# Altium schematic sheet Regulator.SchDoc
size A; SheetNumber: 2; SheetTotal: 2
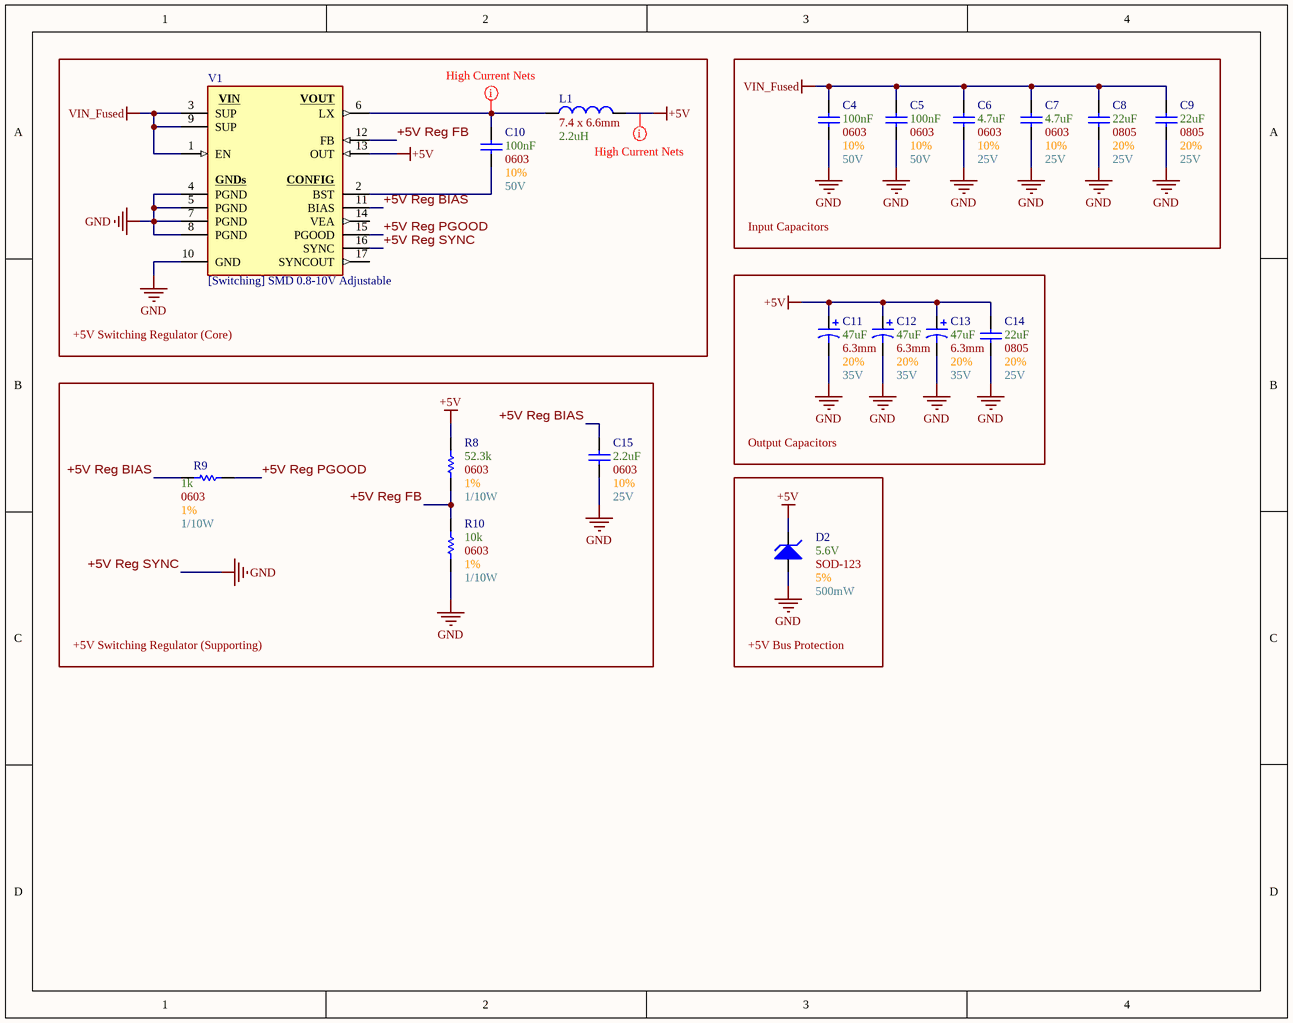
[diagram p0: Regulator.SchDoc]

## Parts
C4  Max Voltage: 50V  Size Package: 0603  Tolerance: 10%  Capacitance: 100nF  [[Cap] SMD 0603]  (hidden comment: [Cap] 0603 0.1uF 10% 50V)
C5  Max Voltage: 50V  Size Package: 0603  Tolerance: 10%  Capacitance: 100nF  [[Cap] SMD 0603]  (hidden comment: [Cap] 0603 0.1uF 10% 50V)
C6  Max Voltage: 25V  Size Package: 0603  Tolerance: 10%  Capacitance: 4.7uF  [[Cap] SMD 0603]  (hidden comment: [Cap] 0603 4.7uF 10% 25V)
C7  Max Voltage: 25V  Size Package: 0603  Tolerance: 10%  Capacitance: 4.7uF  [[Cap] SMD 0603]  (hidden comment: [Cap] 0603 4.7uF 10% 25V)
C8  Max Voltage: 25V  Size Package: 0805  Tolerance: 20%  Capacitance: 22uF  [[Cap] SMD 0805]  (hidden comment: [Cap] 0805 22uF 20% 25V)
C9  Max Voltage: 25V  Size Package: 0805  Tolerance: 20%  Capacitance: 22uF  [[Cap] SMD 0805]  (hidden comment: [Cap] 0805 22uF 20% 25V)
C10  Max Voltage: 50V  Size Package: 0603  Tolerance: 10%  Capacitance: 100nF  [[Cap] SMD 0603]  (hidden comment: [Cap] 0603 0.1uF 10% 50V)
C11  Max Voltage: 35V  Size Package: 6.3mm  Tolerance: 20%  Capacitance: 47uF  [[Cap] SMD Polarized, 6.3mm]  (hidden comment: [Cap] 6.3mm 47uF 20% 35V)
C12  Max Voltage: 35V  Size Package: 6.3mm  Tolerance: 20%  Capacitance: 47uF  [[Cap] SMD Polarized, 6.3mm]  (hidden comment: [Cap] 6.3mm 47uF 20% 35V)
C13  Max Voltage: 35V  Size Package: 6.3mm  Tolerance: 20%  Capacitance: 47uF  [[Cap] SMD Polarized, 6.3mm]  (hidden comment: [Cap] 6.3mm 47uF 20% 35V)
C14  Max Voltage: 25V  Size Package: 0805  Tolerance: 20%  Capacitance: 22uF  [[Cap] SMD 0805]  (hidden comment: [Cap] 0805 22uF 20% 25V)
C15  Max Voltage: 25V  Size Package: 0603  Tolerance: 10%  Capacitance: 2.2uF  [[Cap] SMD 0603]  (hidden comment: [Cap] 0603 2.2uF 10% 25V)
D2  Tolerance: 5%  Wattage: 500mW  Optimal Zener Voltage: 5.6V  [[Diode] SMD SOD-123]  (hidden comment: SOD-123)
L1  Package: 7.4 x 6.6mm  Inductance: 2.2uH  [[Inductor] SMD 7.4 X 6.6 X 3 MM]  (hidden comment: [2.2uH] SMD Nonstandard 10A)
R8  Wattage: 1/10W  Tolerance: 1%  Resistance: 52.3k  Size Package: 0603  [[Res] SMD 0603]  (hidden comment: [52.3k] SMD 0603 1% 1/10W)
R9  Wattage: 1/10W  Tolerance: 1%  Resistance: 1k  Size Package: 0603  [[Res] SMD 0603]  (hidden comment: [1k] SMD 0603 1% 1/10W)
R10  Wattage: 1/10W  Tolerance: 1%  Resistance: 10k  Size Package: 0603  [[Res] SMD 0603]  (hidden comment: [10k] SMD 0603 1% 1/8W)
V1  [Switching] SMD 0.8-10V Adjustable  [[Switching] 0.8-10V Adjustable Buck]

## Blocks framed on the sheet
+5V Switching Regulator (Core): C10 L1 V1
Input Capacitors: C4-C9
Output Capacitors: C11-C14
+5V Switching Regulator (Supporting): C15 R8-R10
+5V Bus Protection: D2

## Nets
+5V: C11.1 C12.1 C13.1 C14.2 D2.1(K) L1.2 R8.2 V1.13(OUT)
+5V Reg SYNC: C4.1 C5.1 C6.1 C7.1 C8.1 C9.1 C11.2 C12.2 C13.2 C14.1 C15.1 D2.2(A) R10.1 V1.4(PGND) V1.5(PGND) V1.7(PGND) V1.8(PGND) V1.10(GND) V1.16(SYNC)  [also labelled GND]
VIN_Fused: C4.2 C5.2 C6.2 C7.2 C8.2 C9.2 V1.1(EN) V1.3(SUP) V1.9(SUP)
+5V Reg BIAS: C15.2 R9.1 V1.11(BIAS)
+5V Reg FB: R8.1 R10.2 V1.12(FB)
+5V Reg PGOOD: R9.2 V1.15(PGOOD)
NetC10_1: C10.1 V1.2(BST)
NetC10_2: C10.2 L1.1 V1.6(LX)

Not connected (* = marked no-connect by the designer): V1 14(VEA) 17(SYNCOUT)

## Layout directives
net class High_Current_Nets: +5V, NetC10_2

## Notes on the sheet
- (in symbol [Switching] SMD 0.8-10V Adjustable) VIN; VOUT; GNDs; CONFIG

## Library data of the parts
C4 C5 C10 = [Cap] 0603 0.1uF 10% 50V: CL10B104KB8NNNC; Supplier 1: DigiKey; Supplier Part Number 1: 1276-1000-6-ND
C6 C7 = [Cap] 0603 4.7uF 10% 25V: GRM188R61E475KE11D; Supplier 1: DigiKey; Supplier Part Number 1: 490-7203-6-ND
C8 C9 C14 = [Cap] 0805 22uF 20% 25V: CL21A226MAYNNWE; Supplier 1: DigiKey; Supplier Part Number 1: 1276-CL21A226MAYNNWECT-ND
C11-C13 = [Cap] 6.3mm 47uF 20% 35V: UWT1V470MCL1GS; Supplier 1: DigiKey; Supplier Part Number 1: 493-2202-1-ND
C15 = [Cap] 0603 2.2uF 10% 25V: GRM188R61E225KA12D; Supplier 1: DigiKey; Supplier Part Number 1: 490-10731-1-ND
D2 = [Zener] SMD 5.6V 1/2W 5%: CMHZ5232B TR PBFREE; Supplier 1: DigiKey; Footprint: SOD-123; Supplier Part Number 1: 1514-CMHZ5232BTRPBFREEDKR-ND
L1 = [2.2uH] SMD Nonstandard 10A: ECS-MPIL0630-2R2MC; Supplier 1: DigiKey; Supplier Part Number 1: XC2402CT-ND
R8 = [52.3k] SMD 0603 1% 1/10W: RC0603FR-0752K3L; Supplier 1: DigiKey; Supplier Part Number 1: 311-52.3KHRCT-ND
R9 = [1k] SMD 0603 1% 1/10W: RMCF0603FT1K00; Supplier 1: DigiKey; Supplier Part Number 1: RMCF0603FT1K00DKR-ND
R10 = [10k] SMD 0603 1% 1/8W: RMCF0603FT10K0; Supplier 1: DigiKey; Supplier Part Number 1: RMCF0603FT10K0DKR-ND
V1 = [Switching] SMD 0.8-10V Adjustable: MAX20408AFOF/VY+; Supplier 1: DigiKey; Supplier Part Number 1: 505-MAX20408AFOF/VY+-ND